# EAGLE design RF1_SSR8_HP_V4 (EAGLE 7.3.0)
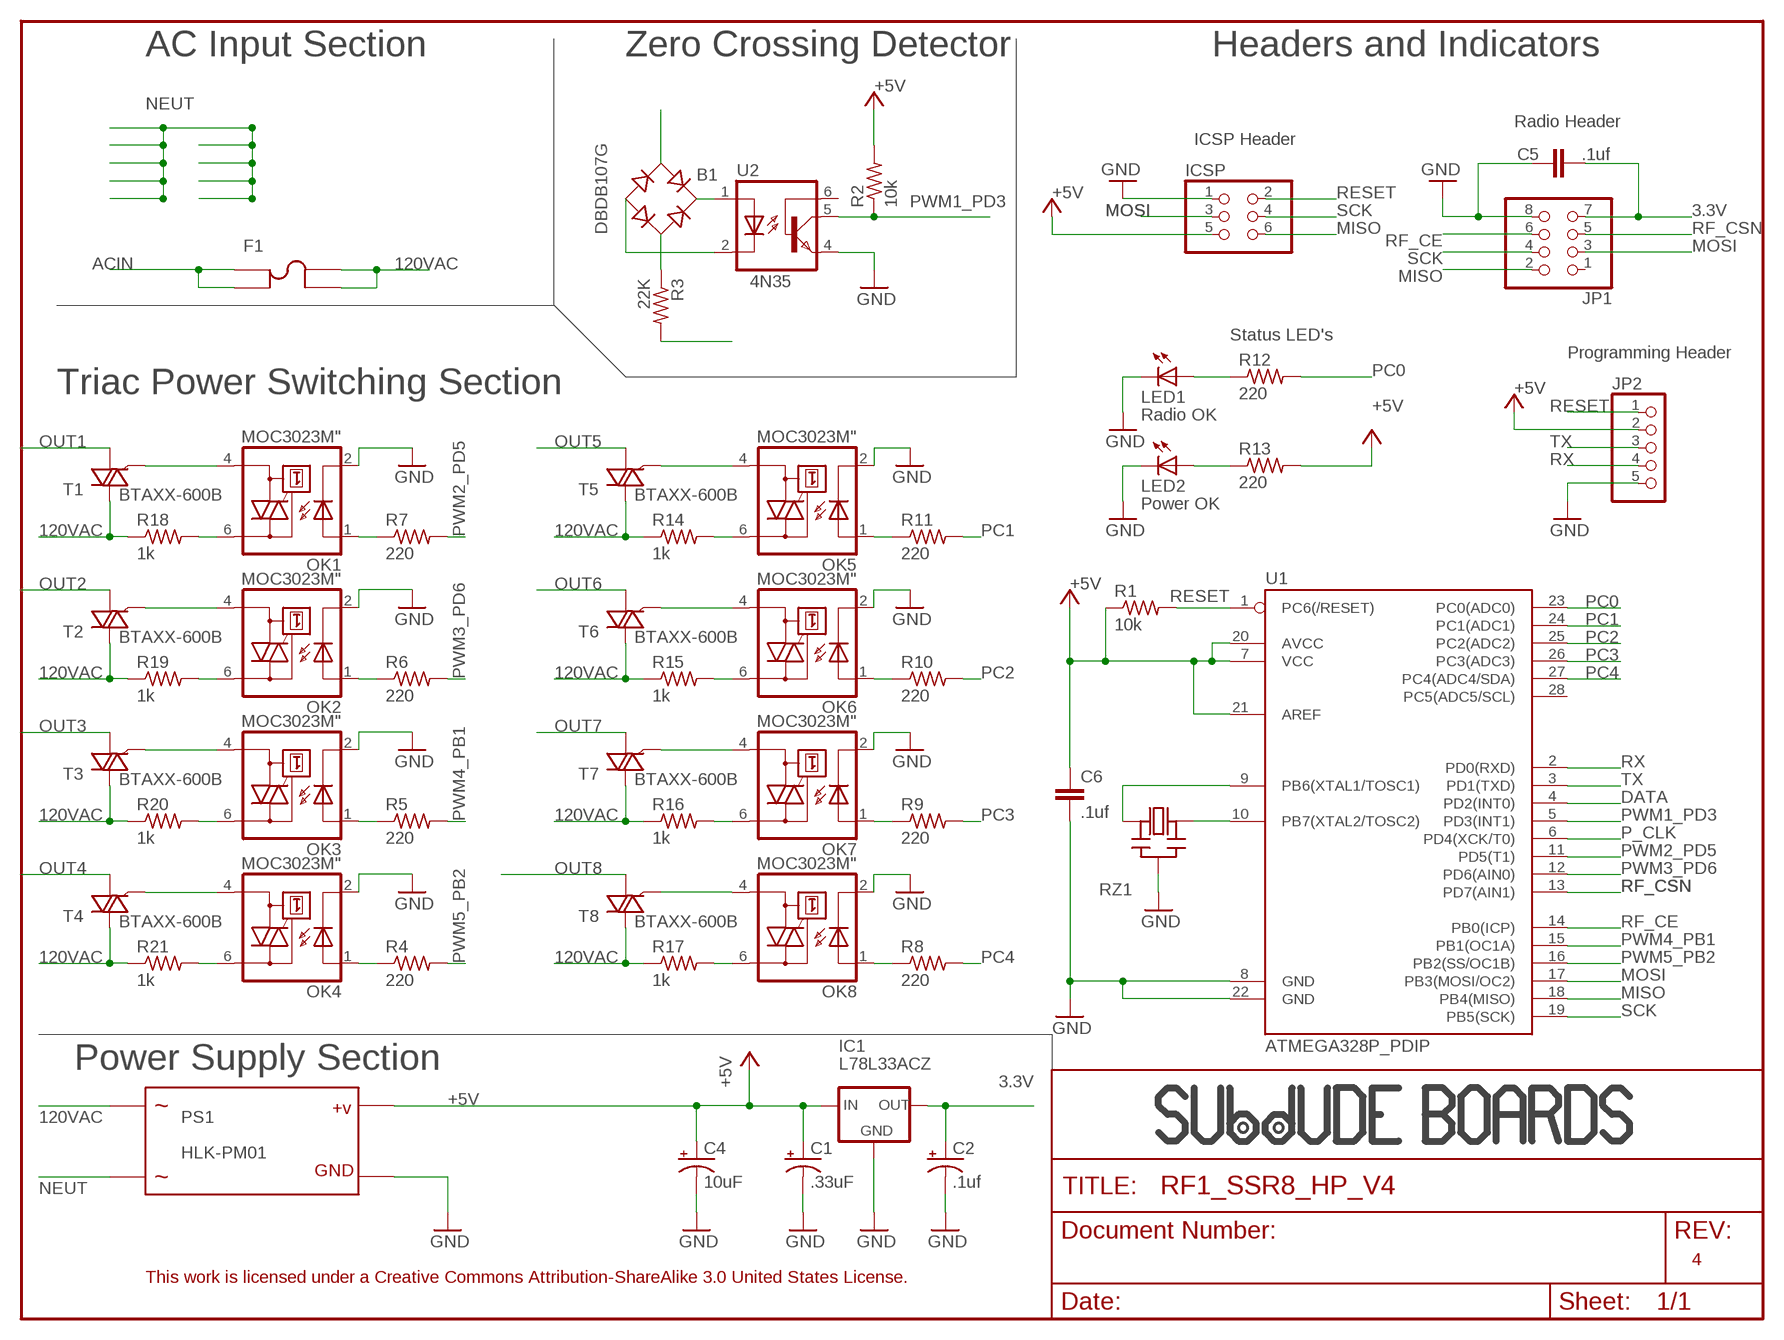
[diagram p0: schematic, sheet 1]

## Parts
B1  DBDB107G  [DB]
C1  .33uF  CPOL-USE1.8-4  [E1,8-4]
C2  .1uf  CPOL-USE1.8-4  [E1,8-4]
C4  10uF  CPOL-USE1.8-4  [E1,8-4]
C5  .1uf  C-EU025-024X044  [C025-024X044]
C6  .1uf  C-EU025-024X044  [C025-024X044]
F1  FUSE5MMPCB  [KE3517]
IC1  L78L33ACZ  78LXX  [78LXX]
ICSP  PINHD-2X3  [2X03]
JP1  PINHD-2X4  [2X04]
JP2  PINHD-1X51X05-BIG  [1X05-BIG]
LED1  LED3MM  [LED3MM]
LED2  LED3MM  [LED3MM]
OK1  MOC3023M"  [DIL06A]
OK2  MOC3023M"  [DIL06A]
OK3  MOC3023M"  [DIL06A]
OK4  MOC3023M"  [DIL06A]
OK5  MOC3023M"  [DIL06A]
OK6  MOC3023M"  [DIL06A]
OK7  MOC3023M"  [DIL06A]
OK8  MOC3023M"  [DIL06A]
PS1  HLK-PM01  [HLK-PM01-STD]
R1  10k  R-US_0207/7  [0207/7]
R2  10k  R-US_0207/2V  [0207/2V]
R3  22K  R-US_0411/12  [0411/12]
R4  220  R-US_0207/2V  [0207/2V]
R5  220  R-US_0207/2V  [0207/2V]
R6  220  R-US_0207/2V  [0207/2V]
R7  220  R-US_0207/2V  [0207/2V]
R8  220  R-US_0207/2V  [0207/2V]
R9  220  R-US_0207/2V  [0207/2V]
R10  220  R-US_0207/2V  [0207/2V]
R11  220  R-US_0207/2V  [0207/2V]
R12  220  R-US_0207/2V  [0207/2V]
R13  220  R-US_0207/2V  [0207/2V]
R14  1k  R-US_0207/2V  [0207/2V]
R15  1k  R-US_0207/2V  [0207/2V]
R16  1k  R-US_0207/2V  [0207/2V]
R17  1k  R-US_0207/2V  [0207/2V]
R18  1k  R-US_0207/2V  [0207/2V]
R19  1k  R-US_0207/2V  [0207/2V]
R20  1k  R-US_0207/2V  [0207/2V]
R21  1k  R-US_0207/2V  [0207/2V]
RZ1  CERMOSCILL-THM  [CERM_OSC]
T1  BTAXX-600B  [TO220BVA]
T2  BTAXX-600B  [TO220BVA]
T3  BTAXX-600B  [TO220BVA]
T4  BTAXX-600B  [TO220BVA]
T5  BTAXX-600B  [TO220BVA]
T6  BTAXX-600B  [TO220BVA]
T7  BTAXX-600B  [TO220BVA]
T8  BTAXX-600B  [TO220BVA]
U1  ATMEGA328P_PDIP  [DIL28-3]
U2  4N35SMALL  [DIL06A]
U$2  SUBDUDE_LOGOLARGE  [SUBDUDE_LARGE]
U$3  SUBDUDE_LOGOSMALL  [SUBDUDE_SMALL]

## Nets
3.3V: C2.+ C5.2 IC1.OUT JP1.7
120VAC: F1.P$2 F1.P$4 PS1.AC_N R3.2 R14.1 R15.1 R16.1 R17.1 R18.1 R19.1 R20.1 R21.1 T1.T2(A2) T2.T2(A2) T3.T2(A2) T4.T2(A2) T5.T2(A2) T6.T2(A2) T7.T2(A2) T8.T2(A2)
+5V: C1.+ C4.+ C6.1 IC1.IN ICSP.5 JP2.2 PS1.VO+ R1.1 R2.2 R13.2 U1.7(VCC) U1.20(AVCC) U1.21(AREF)
ACIN: F1.P$1 F1.P$3
DATA: U1.4(PD2(INT0))
GND [vcc]: C1.- C2.- C4.- C5.1 C6.2 IC1.GND ICSP.1 JP1.8 JP2.5 LED1.K(C) LED2.K(C) OK1.2(C) OK2.2(C) OK3.2(C) OK4.2(C) OK5.2(C) OK6.2(C) OK7.2(C) OK8.2(C) PS1.VO- RZ1.P$2(GND) U1.8(GND) U1.22(GND) U2.4(EMI)
MISO: ICSP.6 JP1.2 U1.18(PB4(MISO))
MOSI: ICSP.3 JP1.3 U1.17(PB3(MOSI/OC2))
N$1: OK1.1(A) R7.1
N$2: OK2.1(A) R6.1
N$3: OK3.1(A) R5.1
N$4: OK4.1(A) R4.1
N$5: RZ1.P$3(OUT) U1.10(PB7(XTAL2/TOSC2))
N$6: RZ1.P$1(IN) U1.9(PB6(XTAL1/TOSC1))
N$7: OK5.1(A) R11.1
N$8: OK6.1(A) R10.1
N$9: OK7.1(A) R9.1
N$10: OK8.1(A) R8.1
N$11: B1.AC2 R3.1
N$12: OK1.6(A2) R18.2
N$13: OK1.4(A1) T1.G
N$14: OK2.6(A2) R19.2
N$15: OK2.4(A1) T2.G
N$16: OK3.6(A2) R20.2
N$17: OK3.4(A1) T3.G
N$18: OK4.6(A2) R21.2
N$19: B1.- U2.2(C)
N$20: B1.+ U2.1(A)
N$21: OK4.4(A1) T4.G
N$22: LED1.A R12.1
N$23: LED2.A R13.1
N$24: OK5.4(A1) T5.G
N$25: OK5.6(A2) R14.2
N$26: OK6.4(A1) T6.G
N$27: OK6.6(A2) R15.2
N$28: OK7.4(A1) T7.G
N$29: OK7.6(A2) R16.2
N$30: OK8.6(A2) R17.2
N$31: OK8.4(A1) T8.G
NEUT: B1.AC1 PS1.AC_L
OUT1: T1.T1(A1)
OUT2: T2.T1(A1)
OUT3: T3.T1(A1)
OUT4: T4.T1(A1)
OUT5: T5.T1(A1)
OUT6: T6.T1(A1)
OUT7: T7.T1(A1)
OUT8: T8.T1(A1)
P_CLK: U1.6(PD4(XCK/T0))
PC0: R12.2 U1.23(PC0(ADC0))
PC1: R11.2 U1.24(PC1(ADC1))
PC2: R10.2 U1.25(PC2(ADC2))
PC3: R9.2 U1.26(PC3(ADC3))
PC4: R8.2 U1.27(PC4(ADC4/SDA))
PWM1_PD3: R2.1 U1.5(PD3(INT1)) U2.5(COL)
PWM2_PD5: R7.2 U1.11(PD5(T1))
PWM3_PD6: R6.2 U1.12(PD6(AIN0))
PWM4_PB1: R5.2 U1.15(PB1(OC1A))
PWM5_PB2: R4.2 U1.16(PB2(SS/OC1B))
RESET: ICSP.2 JP2.1 R1.2 U1.1(PC6(/RESET))
RF_CE: JP1.6 U1.14(PB0(ICP))
RF_CSN: JP1.5 U1.13(PD7(AIN1))
RX: JP2.4 U1.2(PD0(RXD))
SCK: ICSP.4 JP1.4 U1.19(PB5(SCK))
TX: JP2.3 U1.3(PD1(TXD))
Unconnected: JP1.1 U1.28(PC5(ADC5/SCL)) U2.6(BAS)

## Notes on the sheet
- AC Input Section | Zero Crossing Detector | Headers and Indicators
- Radio Header
- ICSP Header
- F1
- 4N35
- Status LED's
- Programming Header
- Triac Power Switching Section
- Radio OK
- Power OK
- Power Supply Section
- 4
- This work is licensed under a Creative Commons Attribution-ShareAlike 3.0 United States License.

## Library data of the parts
B1 = rectifier:DB?*G: Single Phase 1.0 AMP Glass Passivated Bridge Rectifier Taiwan Semiconductor Co.,Ltd. - TSC Source: http://www.taiwansemi.com/TSCbig5/ezcatfiles/cust/img/img/db101g.pdf http://www.ts.com.tw/db/pictures/modules/PDT/PDT060207001/DBLS201G.pdf
C1 C2 C4 = adafruit:CPOL-US: POLARIZED CAPACITOR, American symbol
C5 C6 = resistor:C-EU: CAPACITOR, European symbol
F1 = tim:FUSE5MMPCB: Keystone Electronics 3517
IC1 = v-reg:78LXX: VOLTAGE REGULATOR
ICSP = pinhead:PINHD-2X3: PIN HEADER
JP1 = adafruit:PINHD-2X4: PIN HEADER
JP2 = tim:PINHD-1X5
LED1 LED2 = adafruit:LED: LED OSRAM: - CHIPLED LG R971, LG N971, LY N971, LG Q971, LY Q971, LO R971, LY R971 LH N974, LH R974 LS Q976, LO Q976, LY Q976 LO Q996 - Hyper CHIPLED LW Q18S LB Q993, LB Q99A, LB R99A - SideLED LS A670, LO A670, LY A670, LG A670, LP A670 LB A673, LV A673, LT A673, LW A673 LH A674 LY A675 LS A676, LA A676, LO A676, LY A676, LW A676 LS A679, LY A679, LG A679 - Hyper Micro SIDELED® LS Y876, LA Y876, LO Y876, LY Y876 LT Y87S - SmartLED LW L88C, LW L88S LB L89C, LB L89S, LG L890 LS L89K, LO L89K, LY L89K LS L896, LA L896, LO L896, LY L896 - TOPLED LS T670, LO T670, LY T670, LG T670, LP T670 LSG T670, LSP T670, LSY T670, LOP T670, LYG T670 LG T671, LOG T671, LSG T671 LB T673, LV T673, LT T673, LW T673 LH T674 LS T676, LA T676, LO T676, LY T676, LB T676, LH T676, LSB T676, LW T676 LB T67C, LV T67C, LT T67C, LS T67K, LO T67K, LY T67K, LW E67C LS E67B, LA E67B, LO E67B, LY E67B, LB E67C, LV E67C, LT E67C LW T67C LS T679, LY T679, LG T679 LS T770, LO T770, LY T770, LG T770, LP T770 LB T773, LV T773, LT T773, LW T773 LH T774 LS E675, LA E675, LY E675, LS T675 LS T776, LA T776, LO T776, LY T776, LB T776 LHGB T686 LT T68C, LB T68C - Hyper Mini TOPLED® LB M676 - Mini TOPLED Santana® LG M470 LS M47K, LO M47K, LY M47K Source: http://www.osram.convergy.de/
OK1-OK8 = tim:MOC3023M
PS1 = tim:HLK-PM01
R1 = adafruit:R-US_: RESISTOR, American symbol
R2-R21 = resistor:R-US_: RESISTOR, American symbol
RZ1 = adafruit:CERMOSCILL: Ceramic oscillator with built in capacitors such as ZTT-12MHz http://www.ladyada.net/library/eagle
T1-T8 = tim:BTAXX-600B
U1 = SparkFun-DigitalIC:ATMEGA328P_PDIP: uC used in the Arduino 32kb flash, 1k EEPROM, 2k SRAM This is the through-hole version of this chip.
U2 = tim:4N35: MOTOROLA OPTO COUPLER
U$2 U$3 = tim:SUBDUDE_LOGO

## Net classes
0 default: width 0.203 mm
1 vcc: width 0.305 mm

## Board
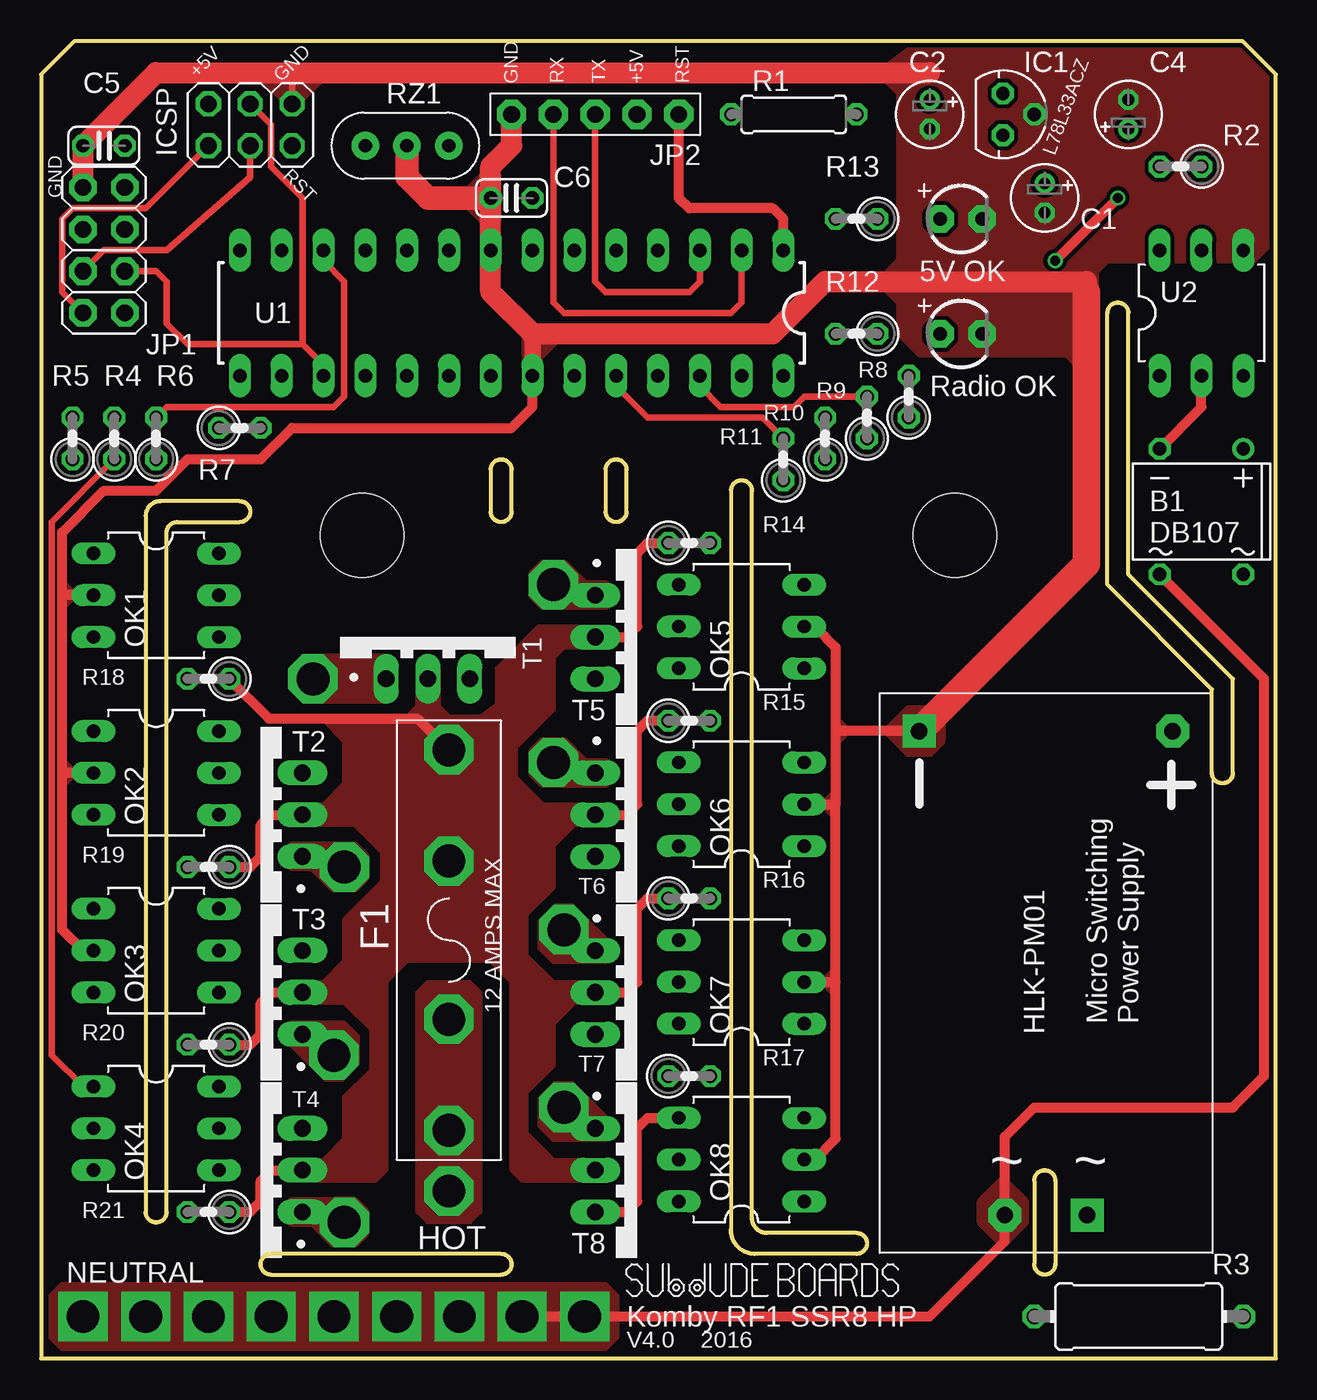
[diagram p1: board, top side]
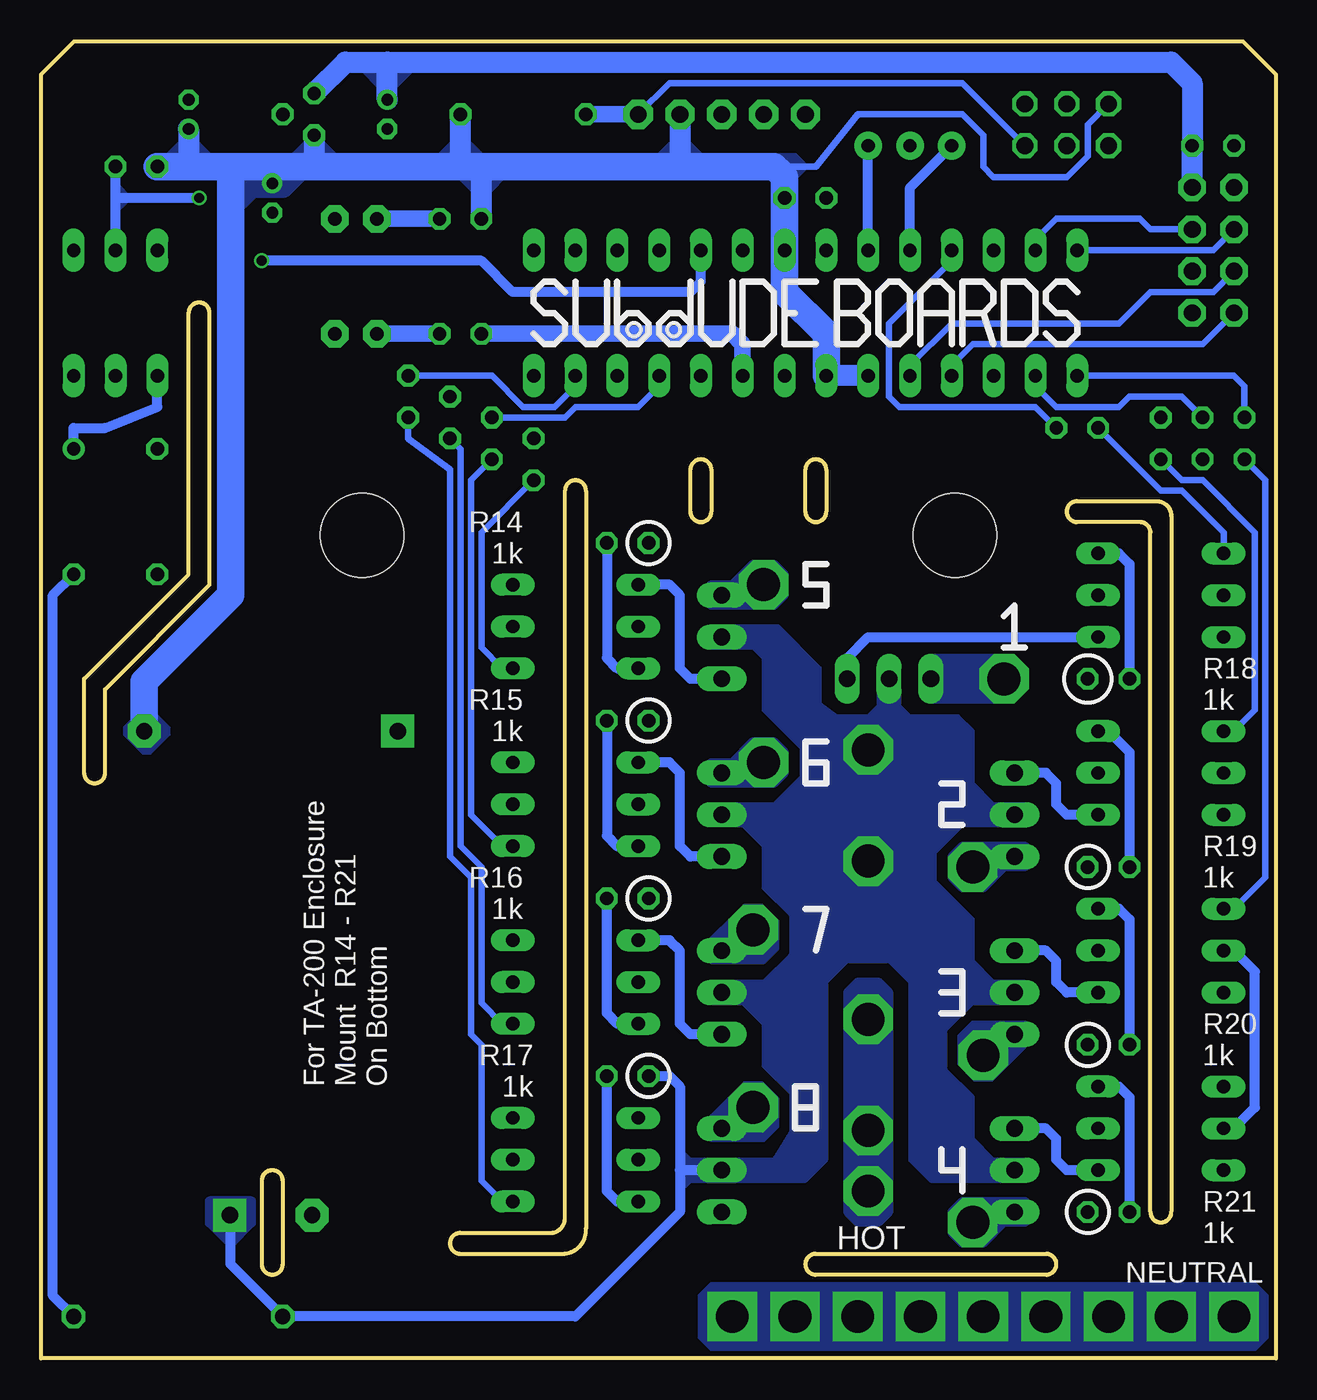
[diagram p2: board, bottom side, seen from below]

Size 75 x 80 mm. Coordinates in mm from the lower left corner, seen from the top.
Outline: 0,0 75,0 75,78 73,80 2,80 0,78 0,0
Copper layers (1*16): Top 0.035mm / dielectric 1.5mm / Bottom 0.035mm
Design rules "dirty": minimum track width 5mil, minimum drill 12mil, track to track 5mil, track to pad 5mil, pad to pad 5mil, via to via 5mil, smd to smd 0mil, copper to edge 10mil, drill to drill 10mil, minimum pad ring 10mil, minimum via ring 6mil, stop-mask expansion 2mil, vias tented up to drill 25mil, thermal gap 10mil
Holes 5.08 mm at 19.5,50 55.5,50
Milling: 41 lines

### Footprints (pad centres in the part's own frame; a part is rotated, then mirrored left to right if it is on the bottom)
DB = drill 0.813: + -2.54,-3.81 | drill 0.813 octagon: - 2.54,-3.81; AC1 2.54,3.81; AC2 -2.54,3.81
E1,8-4 = drill 0.711 pad 1.168: + -0.889,0 | drill 0.711 pad 1.168 octagon: - 0.889,0
C025-024X044 = drill 0.813 octagon: 1 -1.27,0; 2 1.27,0
KE3517 = drill 2 octagon: P$1 -11.557,0; P$2 11.557,0; P$3 -4.801,0; P$4 4.801,0
78LXX = drill 0.813 octagon: GND 0,1.905; IN 1.27,0; OUT -1.27,0
2X03 = drill 1.016 octagon: 1 -2.54,-1.27; 2 -2.54,1.27; 3 0,-1.27; 4 0,1.27; 5 2.54,-1.27; 6 2.54,1.27
2X04 = drill 1.016 pad 1.676 octagon: 1 -3.81,-1.27; 2 -3.81,1.27; 3 -1.27,-1.27; 4 -1.27,1.27; 5 1.27,-1.27; 6 1.27,1.27; 7 3.81,-1.27; 8 3.81,1.27
1X05-BIG = drill 1.016 pad 1.778 octagon: 1 -6.35,0; 2 -3.81,0; 3 -1.27,0; 4 1.27,0; 5 3.81,0
LED3MM = drill 0.813 pad 1.676 octagon: A -1.27,0; K 1.27,0
DIL06A = drill 0.813 long: 1 -2.54,-3.81; 2 0,-3.81; 3 2.54,-3.81; 4 2.54,3.81; 5 0,3.81; 6 -2.54,3.81
HLK-PM01-STD = drill 1 pad 2 octagon: AC_L -14.795,2.42; VO+ 14.605,-7.78 | drill 1 pad 2 square: AC_N -14.795,-2.58; VO- 14.605,7.62
0207/7 = drill 0.813 octagon: 1 -3.81,0; 2 3.81,0
0207/2V = drill 0.813 octagon: 1 -1.27,0; 2 1.27,0
0411/12 = drill 0.914 octagon: 1 -6.35,0; 2 6.35,0
CERM_OSC = drill 0.813 pad 1.676: P$1 -2.54,0; P$2 0,0; P$3 2.54,0
TO220BVA = drill 1.016 long: G 2.54,-2.54; T1 -2.54,-2.54; T2 0,-2.54
DIL28-3 = drill 0.813 long: 1 -16.51,-3.81; 2 -13.97,-3.81; 3 -11.43,-3.81; 4 -8.89,-3.81; 5 -6.35,-3.81; 6 -3.81,-3.81; 7 -1.27,-3.81; 8 1.27,-3.81; 9 3.81,-3.81; 10 6.35,-3.81; 11 8.89,-3.81; 12 11.43,-3.81; 13 13.97,-3.81; 14 16.51,-3.81; 15 16.51,3.81; 16 13.97,3.81; 17 11.43,3.81; 18 8.89,3.81; 19 6.35,3.81; 20 3.81,3.81; 21 1.27,3.81; 22 -1.27,3.81; 23 -3.81,3.81; 24 -6.35,3.81; 25 -8.89,3.81; 26 -11.43,3.81; 27 -13.97,3.81; 28 -16.51,3.81

### Placement (x,y rotation side)
B1  70.48,51.44 180 top
C1  60.96,70.48 270 top
C2  53.98,75.56 270 top
C4  66.04,75.56 90 top
C5  3.81,73.66 0 top
C6  28.57,70.48 180 top
F1  24.77,25.4 90 top
IC1  58.42,75.56 270 top
ICSP  12.7,74.93 180 top
JP1  3.81,67.31 90 top
JP2  32.38,75.56 180 top
LED1  55.88,62.23 0 top
LED2  55.88,69.22 0 top
OK1  6.99,46.35 270 top
OK2  6.99,35.56 270 top
OK3  6.99,24.77 270 top
OK4  6.99,13.97 270 top
OK5  42.55,44.45 90 top
OK6  42.55,33.66 90 top
OK7  42.55,22.86 90 top
OK8  42.55,12.06 90 top
PS1  60.96,23.5 90 top
R1  45.72,75.56 180 top
R2  69.22,72.39 180 top
R3  66.67,2.54 180 top
R4  4.45,55.88 90 top
R5  1.91,55.88 90 top
R6  6.99,55.88 90 top
R7  12.06,56.52 0 top
R8  52.7,58.42 90 top
R9  50.16,57.15 90 top
R10  47.62,55.88 90 top
R11  45.09,54.61 90 top
R12  49.53,62.23 180 top
R13  49.53,69.22 180 top
R14  39.37,49.53 0 top
R15  39.37,38.73 0 top
R16  39.37,27.94 0 top
R17  39.37,17.14 0 top
R18  10.16,41.27 180 top
R19  10.16,29.84 180 top
R20  10.16,19.05 180 top
R21  10.16,8.89 180 top
RZ1  22.23,73.66 180 top
T1  23.5,43.81 0 top
T2  13.34,33.02 90 top
T3  13.34,22.23 90 top
T4  13.34,11.43 90 top
T5  36.2,43.81 270 top
T6  36.2,33.02 270 top
T7  36.2,22.23 270 top
T8  36.2,11.43 270 top
U1  28.57,63.5 180 top
U2  70.48,63.5 0 top
U$2  45.09,61.59 0 bottom
U$3  35.56,3.81 0 top

### Tracks (layer width: path | path; a pad name or v marks a point on that pad's centre or on a via)
3.3V
  Bottom 1.27: JP1.7 C5.2 5.08,77.47 6.35,78.74 53.98,78.74 | IC1.OUT 56.52,78.74 53.98,78.74 | C2.+ 53.98,78.74
  pour Bottom (no thermals): 53.98,77.47 55.24,78.74 52.7,78.74
120VAC
  Top 0.61: T5.T2 35.56,43.81 36.2,44.45 36.2,48.9 36.83,49.53 R14.1 | T6.T2 35.56,33.02 36.2,33.66 36.2,38.1 36.83,38.73 R15.1 | T7.T2 35.56,22.23 36.2,22.86 36.2,27.3 36.83,27.94 R16.1 | R19.1 12.7,29.84 13.34,30.48 13.34,32.38 13.97,33.02 T2.T2 | R20.1 12.7,19.05 13.34,19.68 13.34,21.59 13.97,22.23 T3.T2 | R21.1 12.7,8.89 13.34,9.53 13.34,10.79 13.97,11.43 T4.T2 | R18.1 13.84,38.86 22.86,38.86 F1.P$2
  Bottom 0.61: PS1.AC_N 63.5,8.66 63.5,5.71 R3.2 42.55,2.54 36.2,8.89 36.2,11.43 | R17.1 36.83,17.14 36.2,16.51 36.2,11.43 | T8.T2 36.2,11.43
  pour Bottom (no thermals): 26.04,24.13 23.5,24.13 22.23,22.86 22.23,12.06 20.95,10.79 15.24,10.79 14.61,11.43 15.24,12.06 17.14,12.06 18.41,13.34 18.41,15.88 20.07,17.53 20.07,19.94 18.41,21.59 15.24,21.59 14.61,22.23 15.24,22.86 17.14,22.86 18.41,24.13 18.41,26.67 20.7,28.96 20.7,30.73 19.05,32.38 15.24,32.38 14.61,33.02 15.24,33.66 17.14,33.66 18.41,34.92 18.41,38.1 19.3,38.99 22.23,38.99 22.86,39.62 22.86,41.91 23.5,42.55 24.13,41.91 24.13,39.62 24.77,38.99 26.67,38.99 27.69,39.75 27.69,41.91 30.23,44.45 34.29,44.45 34.92,43.81 34.29,43.18 31.75,43.18 31.11,42.55 31.11,39.37 28.83,37.08 28.83,35.31 30.48,33.66 34.29,33.66 34.92,33.02 34.29,32.38 32.38,32.38 31.11,31.11 31.11,28.57 29.46,26.92 29.46,24.51 31.11,22.86 34.29,22.86 34.92,22.23 34.29,21.59 32.38,21.59 31.11,20.32 31.11,17.78 29.46,16.13 29.46,13.72 30.48,12.06 35.56,12.06 36.2,12.7 36.2,10.16 35.56,10.79 28.57,10.79 27.3,12.06 27.3,22.86
  pour Top (no thermals): 27.69,39.75 27.69,41.91 30.23,44.45 34.29,44.45 34.92,43.81 34.29,43.18 31.75,43.18 31.11,42.55 31.11,39.37 28.83,37.08 28.83,35.31 30.48,33.66 34.29,33.66 34.92,33.02 34.29,32.38 32.38,32.38 31.11,31.11 31.11,28.57 29.46,26.92 29.46,24.51 31.11,22.86 34.29,22.86 34.92,22.23 34.29,21.59 32.38,21.59 31.11,20.32 31.11,17.78 29.46,16.13 29.46,13.72 31.11,12.06 34.29,12.06 34.92,11.43 34.29,10.79 29.21,10.79 28.57,11.43 28.57,22.86 27.3,24.13 22.23,24.13 20.95,22.86 20.95,11.43 20.32,10.79 15.24,10.79 14.61,11.43 15.24,12.06 17.14,12.06 18.41,13.34 18.41,15.88 20.07,17.53 20.07,19.94 18.41,21.59 15.24,21.59 14.61,22.23 15.24,22.86 17.14,22.86 18.41,24.13 18.41,26.67 20.7,28.96 20.7,30.73 19.05,32.38 15.24,32.38 14.61,33.02 15.24,33.66 17.14,33.66 18.41,34.92 18.41,37.47 17.14,38.73 17.14,38.99 22.23,38.99 22.86,39.62 22.86,41.91 23.5,42.55 24.13,41.91 24.13,39.62 24.77,38.99 26.67,38.99
  pour Bottom (no thermals): 63.5,6.99 62.23,8.26 62.23,9.53 64.77,9.53 64.77,8.26
+5V
  Bottom 0.406: 30.16,72.07 29.84,72.39 27.94,72.39 25.4,75.56 19.05,75.56 17.78,74.3 17.78,72.39 17.14,71.75 12.7,71.75 11.43,73.03 11.43,74.93 ICSP.5
  Bottom 1.016: C1.+ 60.96,72.39
  Bottom 1.27: U1.20 U1.21 | R13.2 48.26,72.39 | C4.+ 66.04,72.39 | 49.53,72.39 R1.1 | JP2.2 36.2,72.39 | IC1.IN 58.42,72.39
  Bottom 1.422: 30.48,72.39 30.16,72.07
  Bottom 1.676: U1.21 27.3,62.23 29.84,64.77 U1.7 C6.1 29.84,71.75 30.16,72.07 | 63.5,72.39 60.96,72.39 58.42,72.39 49.53,72.39 48.26,72.39 36.2,72.39 30.48,72.39 | 63.5,72.39 66.04,72.39 R2.2 | PS1.VO+ 68.74,41.12 63.5,46.35 63.5,72.39
  pour Bottom: 28.57,72.39 29.21,73.03 30.48,73.03 29.21,71.75
  pour Bottom: 36.2,73.66 34.92,72.39 37.47,72.39
  pour Bottom: 49.53,73.66 48.26,72.39 50.8,72.39
  pour Bottom (no thermals): 58.42,73.66 57.15,72.39 59.69,72.39
  pour Bottom (no thermals): 66.04,73.66 64.77,72.39 67.31,72.39
  pour Bottom (no thermals): 63.5,69.85 62.23,72.39 59.05,72.39 60.33,71.12 62.23,71.12
  pour Bottom (no thermals): 48.26,71.12 49.53,72.39 46.99,72.39
  pour Bottom (no thermals): 68.58,39.37 67.31,38.1 68.58,36.83 69.85,38.1
ACIN  (via drill 2)
  other vias: 24.77,10.16
  pour Bottom (no thermals): 25.4,8.26 24.13,8.26 23.5,8.89 23.5,22.23 24.13,22.86 25.4,22.86 26.04,22.23 26.04,8.89
  pour Top (no thermals): 26.04,22.86 26.67,22.23 26.67,8.89 26.04,8.26 23.5,8.26 22.86,8.89 22.86,22.23 23.5,22.86
GND
  Top 0.406: ICSP.1 15.24,78.11
  Top 0.61: 48.26,22.86 48.26,13.34 46.99,12.06 OK8.2 | 48.26,22.86 48.26,33.66 | U1.22 29.84,57.78 28.57,56.52 15.24,56.52 13.34,54.61 8.89,54.61 6.99,52.7 3.81,52.7 1.27,50.16 1.27,46.35 | OK5.2 46.99,44.45 48.26,43.18 48.26,38.1 | OK6.2 48.26,33.66 | OK7.2 48.26,22.86 | 1.27,35.56 1.27,26.04 2.54,24.77 OK3.2 | 1.27,35.56 1.27,46.35 | OK1.2 1.27,46.35 | OK2.2 1.27,35.56 | 48.26,38.1 48.26,33.66 | PS1.VO- 48.26,38.1
  Top 1.016: U1.22 29.84,62.23
  Top 1.27: JP2.5 28.57,73.66 27.3,72.39 C6.2 U1.8 27.3,64.77 29.84,62.23 44.45,62.23 47.62,65.41 63.5,65.41 | JP1.8 C5.1 6.99,78.11 15.24,78.11 53.98,78.11
  Top 1.422: RZ1.P$2 22.23,71.75 23.5,70.48 C6.2
  Top 1.676: PS1.VO- 63.5,48.26 63.5,64.77
  Bottom 0.61: OK4.2 2.54,13.97 1.27,15.24 1.27,23.5 2.54,24.77 OK3.2
  pour Top (no thermals): 48.26,34.29 47.62,33.66 48.26,33.02
  pour Top (no thermals): 48.26,23.5 47.62,22.86 48.26,22.23
  pour Top (no thermals): 1.27,34.92 1.91,35.56 1.27,36.2
  pour Top (no thermals): 1.27,45.72 1.91,46.35 1.27,46.99
  pour Top (isolate 0.254, no thermals): 52.07,62.23 53.34,60.96 62.23,60.96 62.87,60.33 62.87,59.69 63.5,60.33 63.5,60.96 64.14,61.59 64.14,66.04 64.77,66.67 73.66,66.67 74.93,67.94 74.93,78.11 73.03,80.01 53.34,80.01 50.8,78.11 52.07,76.83 52.07,66.67 50.8,65.41 52.07,64.14
  pour Top: 48.9,38.1 48.26,38.73 48.26,37.47
  pour Top (no thermals): 51.44,38.1 52.7,39.37 54.61,39.37 54.61,37.47 53.98,36.83 52.7,36.83
  pour Top (no thermals): 26.04,70.48 27.3,71.75 27.3,69.22
  pour Top (no thermals): 29.84,60.96 29.84,62.23 31.11,62.23
  pour Top (no thermals): 15.24,76.2 17.14,78.11 13.34,78.11
MISO
  Top 0.406: ICSP.6 6.35,69.85 1.91,69.85 1.27,69.22 1.27,64.77 JP1.2
  Bottom 0.406: JP1.2 4.45,61.59 18.41,61.59 19.68,60.33 U1.18
MOSI
  Top 0.406: JP1.3 6.99,66.04 7.62,65.41 7.62,62.87 8.89,61.59 15.88,61.59 | 15.88,61.59 17.14,60.33 U1.17 | ICSP.3 13.97,74.93 13.97,72.39 15.88,70.48 15.88,61.59
N$1
  Bottom 0.406: R7.1 6.99,52.7 5.71,52.7 3.17,50.16 OK1.1
N$2
  Bottom 0.406: R6.1 5.71,53.34 4.45,53.34 1.27,50.16 1.27,39.37 2.54,38.1 OK2.1
N$3
  Bottom 0.406: R5.1 0.64,53.34 0.64,29.21 2.54,27.3 OK3.1
N$4
  Top 0.406: R4.1 0.64,50.8 0.64,18.41 2.54,16.51 OK4.1
N$5
  Bottom 0.61: U1.10 22.23,71.12 RZ1.P$3
N$6
  Bottom 0.61: U1.9 RZ1.P$1
N$7
  Bottom 0.406: R11.1 48.26,50.16 48.26,43.18 46.99,41.91 OK5.1
N$8
  Bottom 0.406: R10.1 48.9,53.34 48.9,33.02 46.99,31.11 OK6.1
N$9
  Bottom 0.406: R9.1 49.53,55.24 49.53,31.11 48.26,29.84 48.26,21.59 46.99,20.32 OK7.1
N$10
  Bottom 0.406: R8.1 52.7,55.88 50.16,53.98 50.16,30.48 48.9,29.21 48.9,19.68 48.26,19.05 48.26,10.79 46.99,9.53 OK8.1
N$11
  Bottom 0.61: R3.1 74.3,3.81 74.3,46.35 B1.AC2
N$12
  Bottom 0.61: OK1.6 9.53,48.9 8.89,48.26 R18.2
N$13
  Bottom 0.61: T1.G 26.04,42.55 24.77,43.81 OK1.4
N$14
  Bottom 0.61: OK2.6 10.16,38.1 8.89,36.83 R19.2
N$15
  Bottom 0.61: OK2.4 12.7,33.02 13.34,33.66 13.34,34.92 13.97,35.56 T2.G
N$16
  Bottom 0.61: OK3.6 9.53,27.3 8.89,26.67 R20.2
N$17
  Bottom 0.61: OK3.4 12.7,22.23 13.34,22.86 13.34,24.13 13.97,24.77 T3.G
N$18
  Bottom 0.61: OK4.6 9.53,16.51 8.89,15.88 R21.2
N$19
  Top 0.61: B1.- 70.48,57.78 U2.2
N$20
  Bottom 0.61: B1.+ 73.03,56.52 71.12,56.52 67.94,57.78 U2.1
N$21
  Bottom 0.61: OK4.4 12.7,11.43 13.34,12.06 13.34,13.34 13.97,13.97 T4.G
N$22
  Bottom 1.016: R12.1 LED1.A
N$23
  Bottom 1.016: LED2.A R13.1
N$24
  Bottom 0.61: T5.G 35.56,41.27 36.2,41.91 36.2,46.35 36.83,46.99 OK5.4
N$25
  Bottom 0.61: R14.2 40.64,42.55 40.01,41.91 OK5.6
N$26
  Bottom 0.61: T6.G 35.56,30.48 36.2,31.11 36.2,35.56 36.83,36.2 OK6.4
N$27
  Bottom 0.61: R15.2 40.64,31.75 40.01,31.11 OK6.6
N$28
  Bottom 0.61: T7.G 35.56,19.68 36.2,20.32 36.2,24.77 36.83,25.4 OK7.4
N$29
  Bottom 0.61: OK7.6 40.01,20.32 40.64,20.95 R16.2
N$30
  Bottom 0.61: OK8.6 40.01,9.53 40.64,10.16 R17.2
N$31
  Top 0.61: T8.G 35.56,8.89 36.2,9.53 36.2,13.97 36.83,14.61 OK8.4
NEUT  (via drill 2)
  Top 0.61: v29.21,2.54 53.98,2.54 58.54,7.11 PS1.AC_L 58.54,13.46 60.33,15.24 72.39,15.24 74.3,17.14 74.3,41.27 B1.AC1
  other vias: 2.54,2.54 6.35,2.54 10.16,2.54 13.97,2.54 17.78,2.54 21.59,2.54 25.4,2.54 33.02,2.54
  pour Top (no thermals): 1.27,0.64 0.64,1.27 0.64,3.81 1.27,4.45 34.29,4.45 34.92,3.81 34.92,1.27 34.29,0.64
  pour Bottom (no thermals): 1.27,4.45 34.29,4.45 34.92,3.81 34.92,1.27 34.29,0.64 1.27,0.64 0.64,1.27 0.64,3.81
  pour Top (no thermals): 57.15,8.89 57.15,9.53 58.42,10.79 59.69,9.53 59.69,8.26 58.42,6.99 57.15,8.26
OUT1  (via drill 2)
  other vias: 16.51,41.27
  pour Bottom (no thermals): 15.24,41.27 16.51,42.55 20.95,42.55 20.95,40.01 16.51,40.01
  pour Top (no thermals): 15.24,41.27 16.51,42.55 20.95,42.55 20.95,40.01 16.51,40.01
OUT2  (via drill 2)
  other vias: 18.41,29.84
  pour Bottom (no thermals): 15.24,31.11 19.05,31.11 19.68,30.48 19.68,29.21 19.05,28.57 17.78,28.57 16.51,29.84 15.24,29.84 14.61,30.48
  pour Top (no thermals): 15.24,31.11 19.05,31.11 19.68,30.48 19.68,29.21 19.05,28.57 17.78,28.57 16.51,29.84 15.24,29.84 14.61,30.48
OUT3  (via drill 2)
  other vias: 17.78,18.41
  pour Bottom (no thermals): 15.24,20.32 18.41,20.32 19.18,19.56 19.18,17.91 18.29,17.02 17.27,17.02 14.61,19.68
  pour Top (no thermals): 14.61,19.68 15.24,20.32 18.41,20.32 19.18,19.56 19.18,17.91 18.29,17.02 17.27,17.02
OUT4  (via drill 2)
  other vias: 18.41,8.26
  pour Bottom (no thermals): 15.24,9.53 19.05,9.53 19.68,8.89 19.68,7.62 19.05,6.99 17.78,6.99 16.51,8.26 15.24,8.26 14.61,8.89
  pour Top (no thermals): 14.61,8.89 15.24,9.53 19.05,9.53 19.68,8.89 19.68,7.62 19.05,6.99 17.78,6.99 16.51,8.26 15.24,8.26
OUT5  (via drill 2)
  other vias: 31.11,46.99
  pour Bottom (no thermals): 31.75,48.26 30.48,48.26 29.84,47.62 29.84,46.35 30.48,45.72 34.29,45.72 34.92,46.35 34.29,46.99 33.02,46.99
  pour Top (no thermals): 31.75,48.26 33.02,46.99 34.29,46.99 34.92,46.35 34.29,45.72 30.48,45.72 29.84,46.35 29.84,47.62 30.48,48.26
OUT6  (via drill 2)
  other vias: 31.11,36.2
  pour Bottom (no thermals): 31.75,37.47 30.48,37.47 29.84,36.83 29.84,35.56 30.48,34.92 34.29,34.92 34.92,35.56 34.29,36.2 33.02,36.2
  pour Top (no thermals): 34.92,35.56 34.29,36.2 33.02,36.2 31.75,37.47 30.48,37.47 29.84,36.83 29.84,35.56 30.48,34.92 34.29,34.92
OUT7  (via drill 2)
  other vias: 31.75,26.04
  pour Bottom (no thermals): 30.35,26.54 31.24,27.43 32.26,27.43 34.92,24.77 34.29,24.13 31.11,24.13 30.35,24.89
  pour Top (no thermals): 34.92,24.77 32.26,27.43 31.24,27.43 30.35,26.54 30.35,24.89 31.11,24.13 34.29,24.13
OUT8  (via drill 2)
  other vias: 31.75,15.24
  pour Bottom (no thermals): 30.35,15.75 31.24,16.64 32.26,16.64 34.92,13.97 34.29,13.34 31.11,13.34 30.35,14.1
  pour Top (no thermals): 34.92,13.97 32.26,16.64 31.24,16.64 30.35,15.75 30.35,14.1 31.11,13.34 34.29,13.34
PC0
  Bottom 1.016: U1.23 32.38,61.59 33.02,62.23 R12.2
PC1
  Top 0.406: U1.24 34.92,59.05 36.83,57.15 43.81,57.15 R11.2
PC2
  Bottom 0.406: U1.25 37.47,59.05 38.73,57.78 42.55,57.78 43.18,57.15 R10.2
PC3
  Top 0.406: R9.2 46.35,58.42 45.72,57.78 41.27,57.78 40.01,59.05 U1.26
PC4
  Bottom 0.406: U1.27 42.55,59.05 43.81,57.78 45.72,57.78 47.62,59.69 R8.2
PWM1_PD3  (via drill 0.6)
  Top 0.61: v61.59,66.67 v65.41,70.48
  Bottom 0.61: U1.5 34.92,65.41 35.56,64.77 46.35,64.77 48.26,66.67 v61.59,66.67 | U2.5 70.48,70.48 | 70.48,70.48 R2.1 | v65.41,70.48 70.48,70.48
  pour Bottom: 69.85,70.48 70.48,71.12 70.48,69.85
PWM2_PD5
  Bottom 0.406: U1.11 19.68,66.67 23.5,62.87 23.5,58.42 22.86,57.78 14.61,57.78 R7.2
PWM3_PD6
  Top 0.406: U1.12 17.14,66.67 18.41,65.41 18.41,58.42 17.78,57.78 7.62,57.78 R6.2
PWM4_PB1
  Bottom 0.406: U1.15 2.54,59.69 1.91,59.05 R5.2
PWM5_PB2
  Bottom 0.406: U1.16 14.61,59.05 13.34,57.78 9.53,57.78 8.89,58.42 5.71,58.42 R4.2
RESET
  Top 0.61: U1.1 45.09,69.22 44.45,69.85 39.37,69.85 38.73,70.48 JP2.1
  Bottom 0.406: JP2.1 36.83,77.47 19.05,77.47 ICSP.2
  Bottom 1.016: JP2.1 R1.2
RF_CE
  Bottom 0.406: JP1.6 3.81,67.31 U1.14
RF_CSN
  Bottom 0.406: JP1.5 7.62,68.58 8.26,69.22 13.34,69.22 14.61,67.94 U1.13
RX
  Top 0.406: JP2.4 31.11,64.14 31.75,63.5 41.91,63.5 42.55,64.14 U1.2
SCK
  Top 0.406: ICSP.4 12.7,71.75 7.62,67.31 3.81,67.31 JP1.4
  Bottom 0.406: JP1.4 3.81,64.77 7.62,64.77 9.53,62.87 19.68,62.87 22.23,60.33 U1.19
TX
  Top 0.406: JP2.3 33.66,65.41 34.29,64.77 39.37,64.77 40.01,65.41 U1.3

### Text on the board
tNames: +5V | GND | GND | RX | TX | +5V | RST | L78L33ACZ | RST | GND | 5V OK | Radio OK | DB107 | F1 | 12 AMPS MAX | Micro Switching | Power Supply | HOT | NEUTRAL | Komby RF1 SSR8 HP | V4.0 2016
bNames: R14 | 1k | R18 | R15 | 1k | 1k | R19 | R16 | 1k | 1k | R20 | R17 | 1k | 1k | On Bottom | Mount R14 - R21 | For TA-200 Enclosure | R21 | 1k | HOT | NEUTRAL
tValues: MOSI | 10uf | .1uf | 10K | MISO | SCK | .1uf | 3.3V | .1uf | CE | CSN | .33uf | SCK | MOSI | MISO | 4N35 | MOC3023 | MOC3023 | MOC3023 | MOC3023 | MOC3023 | MOC3023 | MOC3023 | MOC3023 | 1W